# Altium schematic sheet sensor.SchDoc
size A3
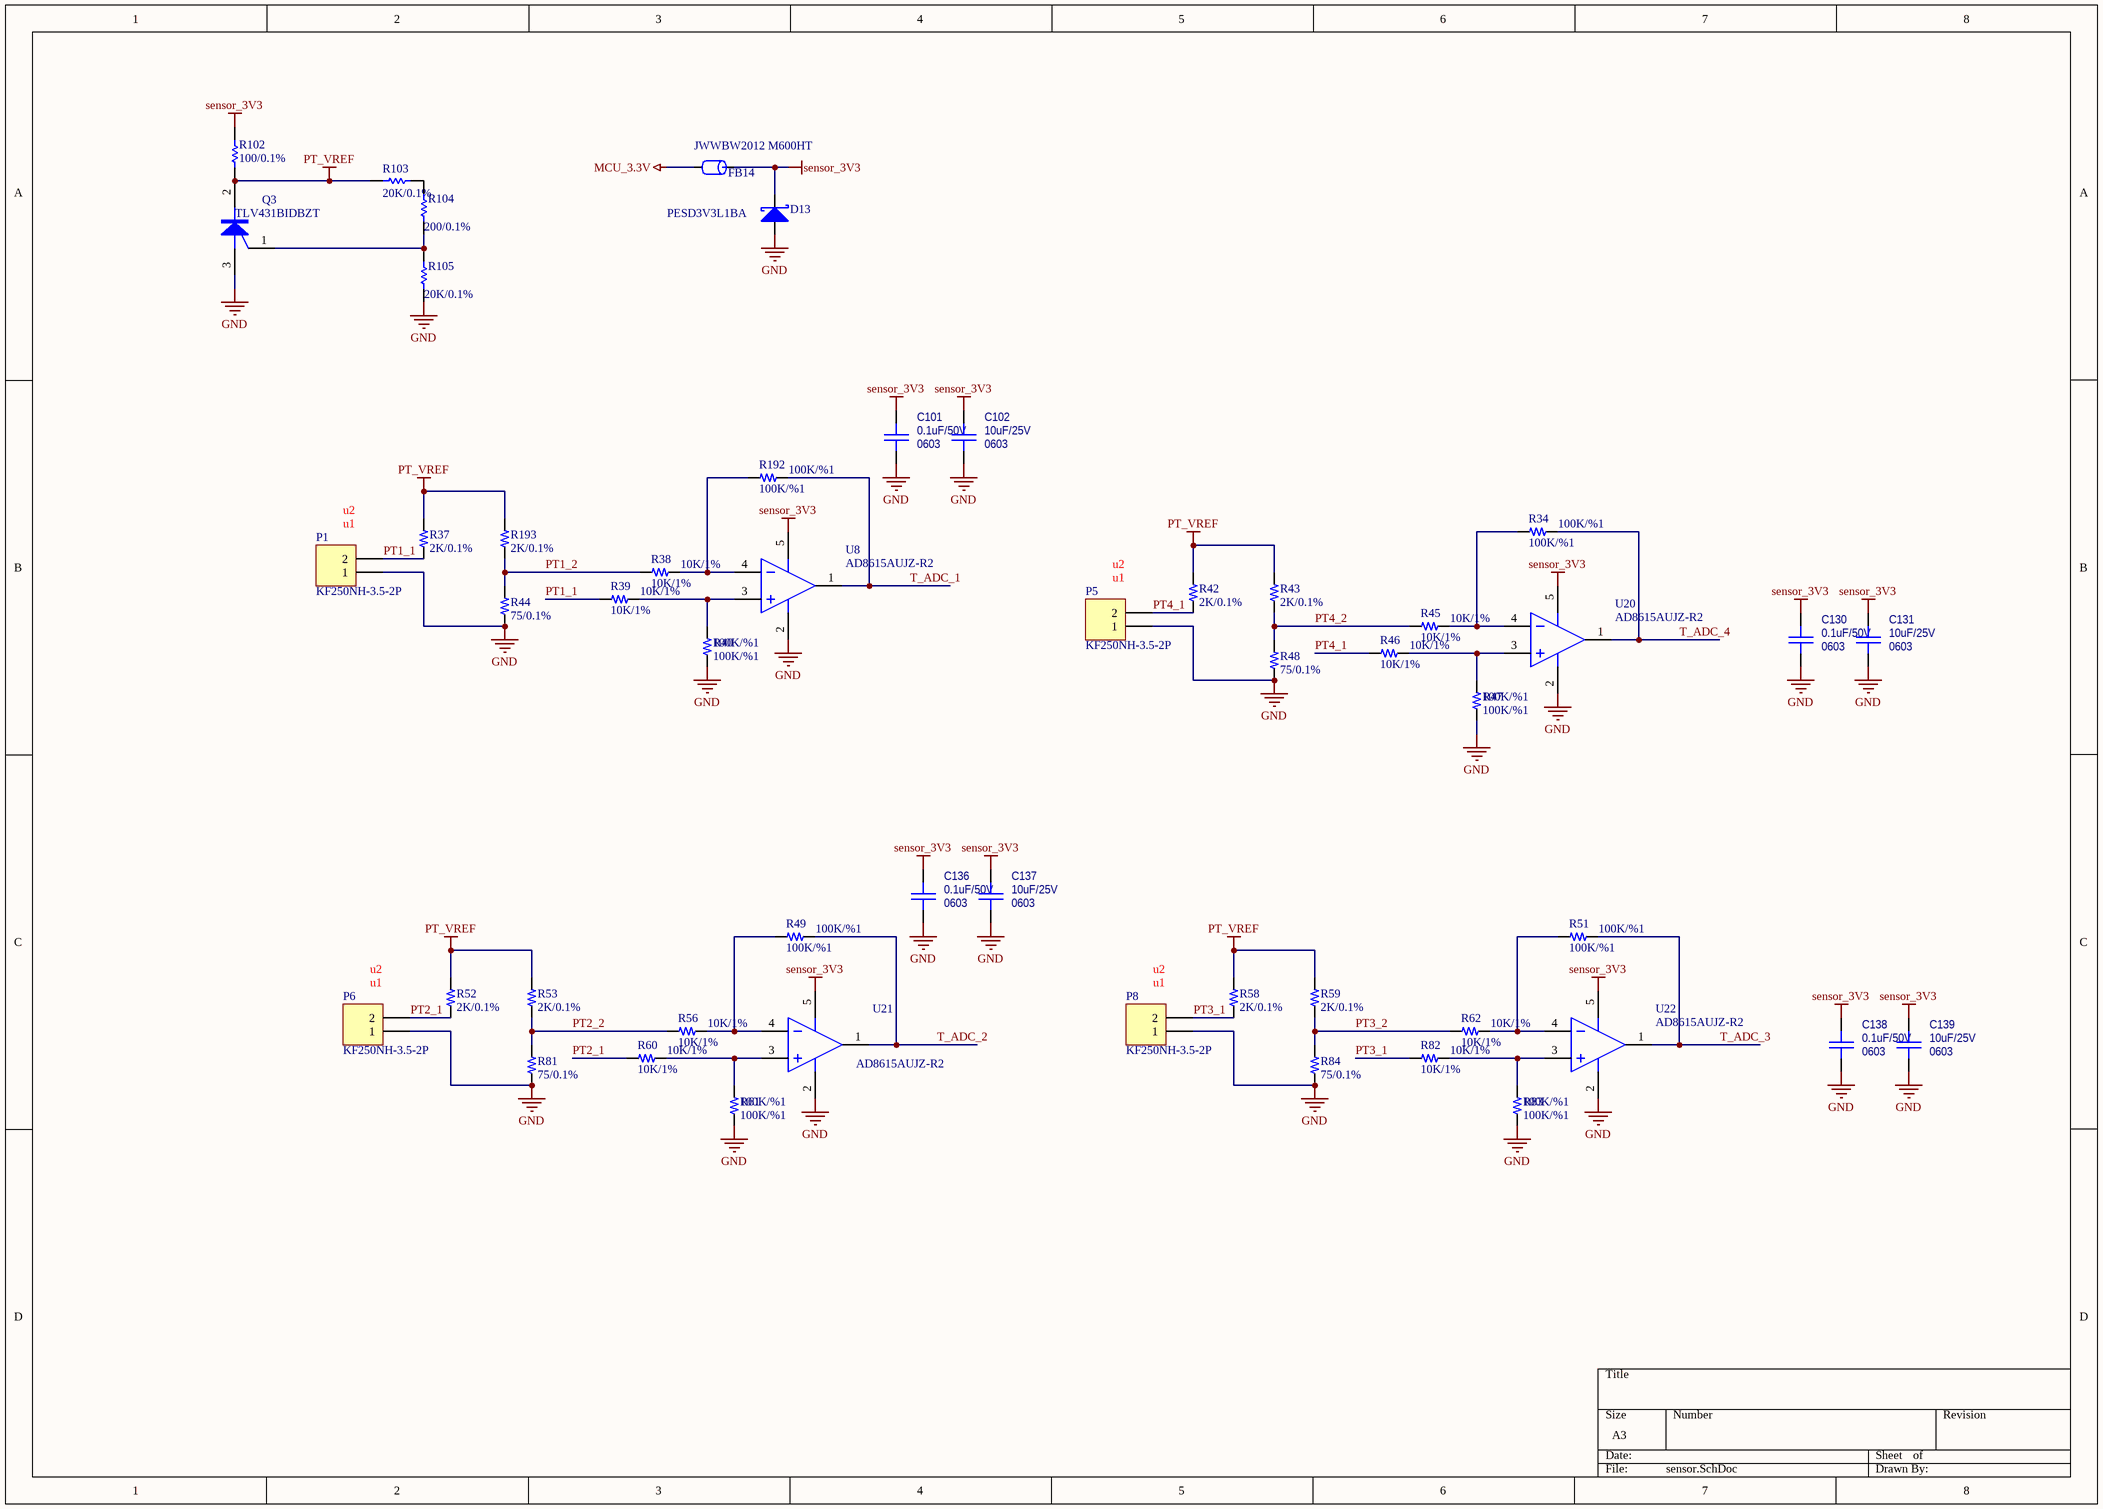
[diagram p0: sensor.SchDoc]

## Parts
C101  Package: 0603  [CAPC1608X092N_0603]  (hidden comment: 0.1uF/50V)
C102  Package: 0603  [CAPC1608X092N_0603]  (hidden comment: 10uF/25V)
C130  Package: 0603  [CAPC1608X092N_0603]  (hidden comment: 0.1uF/50V)
C131  Package: 0603  [CAPC1608X092N_0603]  (hidden comment: 10uF/25V)
C136  Package: 0603  [CAPC1608X092N_0603]  (hidden comment: 0.1uF/50V)
C137  Package: 0603  [CAPC1608X092N_0603]  (hidden comment: 10uF/25V)
C138  Package: 0603  [CAPC1608X092N_0603]  (hidden comment: 0.1uF/50V)
C139  Package: 0603  [CAPC1608X092N_0603]  (hidden comment: 10uF/25V)
D13  PESD3V3L1BA  [SOD323]
FB14  JWWBW2012 M600HT  [0805CZ]
P1  KF250NH-3.5-2P  [KF250NH-3.5-2P]
P5  KF250NH-3.5-2P  [KF250NH-3.5-2P]
P6  KF250NH-3.5-2P  [KF250NH-3.5-2P]
P8  KF250NH-3.5-2P  [KF250NH-3.5-2P]
Q3  TLV431BIDBZT  [SOT23-3]
R34  100K/%1  [RESC1608X055N_0603]
R37  2K/0.1%  [RESC1608X055N_0603]
R38  10K/1%  [RESC1608X055N_0603]
R39  10K/1%  [RESC1608X055N_0603]
R40  100K/%1  [RESC1608X055N_0603]
R42  2K/0.1%  [RESC1608X055N_0603]
R43  2K/0.1%  [RESC1608X055N_0603]
R44  75/0.1%  [RESC1608X055N_0603]
R45  10K/1%  [RESC1608X055N_0603]
R46  10K/1%  [RESC1608X055N_0603]
R47  100K/%1  [RESC1608X055N_0603]
R48  75/0.1%  [RESC1608X055N_0603]
R49  100K/%1  [RESC1608X055N_0603]
R51  100K/%1  [RESC1608X055N_0603]
R52  2K/0.1%  [RESC1608X055N_0603]
R53  2K/0.1%  [RESC1608X055N_0603]
R56  10K/1%  [RESC1608X055N_0603]
R58  2K/0.1%  [RESC1608X055N_0603]
R59  2K/0.1%  [RESC1608X055N_0603]
R60  10K/1%  [RESC1608X055N_0603]
R61  100K/%1  [RESC1608X055N_0603]
R62  10K/1%  [RESC1608X055N_0603]
R81  75/0.1%  [RESC1608X055N_0603]
R82  10K/1%  [RESC1608X055N_0603]
R83  100K/%1  [RESC1608X055N_0603]
R84  75/0.1%  [RESC1608X055N_0603]
R102  100/0.1%  [RESC1608X055N_0603]
R103  20K/0.1%  [RESC1608X055N_0603]
R104  200/0.1%  [RESC1608X055N_0603]
R105  20K/0.1%  [RESC1608X055N_0603]
R192  100K/%1  [RESC1608X055N_0603]
R193  2K/0.1%  [RESC1608X055N_0603]
U8  AD8615AUJZ-R2  [sot-23-5]
U20  AD8615AUJZ-R2  [sot-23-5]
U21  AD8615AUJZ-R2  [sot-23-5]
U22  AD8615AUJZ-R2  [sot-23-5]

## Nets
GND: C101.2 C102.2 C130.2 C131.2 C136.2 C137.2 C138.2 C139.2 D13.1(A) P1.1 P5.1 P6.1 P8.1 Q3.3(A) R40.2 R44.1 R47.2 R48.1 R61.2 R81.1 R83.2 R84.1 R105.2 U8.2(G) U20.2(G) U21.2(G) U22.2(G)
MCU_3.3V: FB14.2
PT_VREF: Q3.2(K) R37.2 R42.2 R43.2 R52.2 R53.2 R58.2 R59.2 R102.2 R103.1 R193.2
sensor_3V3: C101.1 C102.1 C130.1 C131.1 C136.1 C137.1 C138.1 C139.1 D13.2(K) FB14.1 R102.1 U8.5(VCC) U20.5(VCC) U21.5(VCC) U22.5(VCC)
PT1_1: P1.2 R37.1 R39.2
PT1_2: R38.2 R44.2 R193.1
PT2_1: P6.2 R52.1 R60.2
PT2_2: R53.1 R56.2 R81.2
PT3_1: P8.2 R58.1 R82.2
PT3_2: R59.1 R62.2 R84.2
PT4_1: P5.2 R42.1 R46.2
PT4_2: R43.1 R45.2 R48.2
T_ADC_1: R192.1 U8.1(OS_NUL)
T_ADC_2: R49.1 U21.1(OS_NUL)
T_ADC_3: R51.1 U22.1(OS_NUL)
T_ADC_4: R34.1 U20.1(OS_NUL)
NetQ3_1: Q3.1(G) R104.2 R105.1
NetR34_2: R34.2 R45.1 U20.4(V-)
NetR38_1: R38.1 R192.2 U8.4(V-)
NetR39_1: R39.1 R40.1 U8.3(V+)
NetR46_1: R46.1 R47.1 U20.3(V+)
NetR49_2: R49.2 R56.1 U21.4(V-)
NetR51_2: R51.2 R62.1 U22.4(V-)
NetR60_1: R60.1 R61.1 U21.3(V+)
NetR82_1: R82.1 R83.1 U22.3(V+)
NetR103_2: R103.2 R104.1

## Notes on the sheet
- (near P1) u2
- (near P1) u1
- (near P5) u1
- (near P5) u2
- (near P6) u1
- (near P6) u2
- (near P8) u1
- (near P8) u2

## Library data of the parts
C101 C130 C136 C138 = Capacitor_0603: PartNumber: CC0603KRX7R9BB104; Tolerance: [tol]; TempCo: [tempco]; Voltage Rating: [voltage]; Supplier 1: *; Supplier Part Number 1: *; Value: 0.1uF/50V; SupplierDescription: CAP CER 0.1UF 50V X7R 0603
C102 C131 C137 C139 = Capacitor_0603: PartNumber: GRM188R61E106MA73D; Tolerance: [tol]; TempCo: [tempco]; Voltage Rating: [voltage]; Supplier 1: *; Supplier Part Number 1: *; Value: 10uF/25V; SupplierDescription: CAP CER 0.1UF 50V X7R 0603
D13 = DIODE S: Value: PESD3V3L1BA; PartNumber: PESD3V3L1BA
FB14 = FB: Part Field 1: 磁珠/0603/1K ohm/100MHz; PartNumber: BLM21PG221SN1D; Text Field1: FB; Value: JWWBW2012 M600HT; Package: 0805
P1 P5 P6 P8 = Header 2: Publisher: Altium Limited; Value: KF250NH-3.5-2P; PartNumber: KF250NH-3.5-2P
Q3 = PUT: Programmable Unijunction Transistor; PartNumber: TLV431BIDBZR; Value: TLV431BIDBZR; Published: 8-Jun-2000; LatestRevisionDate: 17-Jul-2002; LatestRevisionNote: Re-released for DXP Platform.; PackageReference: TO-52; Publisher: Altium Limited
R34 R40 R47 R49 R51 R61 R83 R192 = R: PartNumber: RC0603FR-07100KL; Value: 100K/%1; Package: 0603
R37 R42 R43 R52 R53 R58 R59 R193 = R: Value: 2K/0.1%; Package: 0603
R38 R39 R45 R46 R56 R60 R62 R82 = R: PartNumber: RC0603FR-0710KL; Value: 10K/1%; Package: 0603
R44 R48 R81 R84 = R: PartNumber: RT0603BRD0775RL; Value: 75/0.1%; Package: 0603
R102 = Res1: Resistor; PartNumber: RT0603BRD07100RL; Published: 8-Jun-2000; LatestRevisionDate: 17-Jul-2002; LatestRevisionNote: Re-released for DXP Platform.; PackageReference: AXIAL-0.3; Publisher: Altium Limited; Package: 0603; Value: 100/0.1%
R103 R105 = Res1: Resistor; PartNumber: RT0603BRD0720KL; Published: 8-Jun-2000; LatestRevisionDate: 17-Jul-2002; LatestRevisionNote: Re-released for DXP Platform.; PackageReference: AXIAL-0.3; Publisher: Altium Limited; Value: 20K/0.1%; Package: 0603
R104 = Res1: Resistor; PartNumber: RT0603BRD07200RL; Published: 8-Jun-2000; LatestRevisionDate: 17-Jul-2002; LatestRevisionNote: Re-released for DXP Platform.; PackageReference: AXIAL-0.3; Publisher: Altium Limited; Value: 200/0.1%; Package: 0603
U8 U20-U22 = AD8615: Value: AD8615AUJZ-R2; PartNumber: AD8615AUJZ-R2